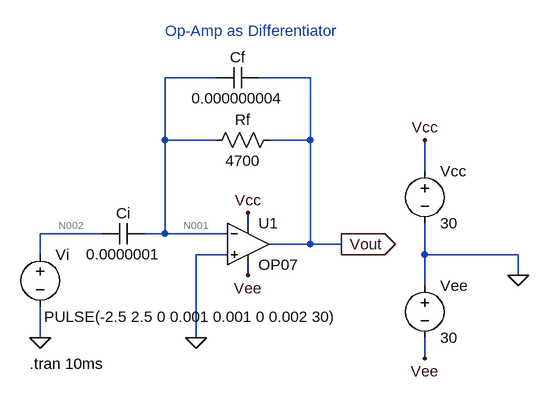
[diagram p0: schematic Assignment 9(ii).asc]
Assignment 9(ii).asc, the LTspice schematic file:
Version 4
SHEET 1 880 680
WIRE 144 -112 64 -112
WIRE 288 -112 208 -112
WIRE 64 -16 64 -112
WIRE 144 -16 64 -16
WIRE 288 -16 288 -112
WIRE 288 -16 224 -16
WIRE 464 32 464 -16
WIRE 192 112 192 96
WIRE -32 128 -128 128
WIRE 64 128 64 -16
WIRE 64 128 32 128
WIRE 160 128 64 128
WIRE 288 144 288 -16
WIRE 288 144 224 144
WIRE 336 144 288 144
WIRE -128 160 -128 128
WIRE 160 160 112 160
WIRE 464 160 464 112
WIRE 608 160 464 160
WIRE 192 192 192 176
WIRE 608 192 608 160
WIRE 464 208 464 160
WIRE -128 288 -128 240
WIRE 112 288 112 160
WIRE 464 320 464 288
FLAG -128 288 0
FLAG 112 288 0
FLAG 336 144 Vout
IOPIN 336 144 Out
FLAG 608 192 0
FLAG 464 -16 Vcc
FLAG 192 96 Vcc
FLAG 464 320 Vee
FLAG 192 192 Vee
SYMBOL Opamps\\OP07 192 80 R0
SYMATTR InstName U1
SYMBOL voltage 464 16 R0
WINDOW 123 0 0 Left 2
WINDOW 39 0 0 Left 2
SYMATTR InstName Vcc
SYMATTR Value 30
SYMBOL voltage 464 192 R0
WINDOW 123 0 0 Left 2
WINDOW 39 0 0 Left 2
SYMATTR InstName Vee
SYMATTR Value 30
SYMBOL voltage -128 144 R0
WINDOW 3 6 112 Left 2
WINDOW 123 0 0 Left 2
WINDOW 39 0 0 Left 2
SYMATTR InstName Vi
SYMATTR Value PULSE(-2.5 2.5 0 0.001 0.001 0 0.002 30)
SYMBOL cap 32 112 R90
WINDOW 0 0 32 VBottom 2
WINDOW 3 32 32 VTop 2
SYMATTR InstName Ci
SYMATTR Value 0.0000001
SYMBOL res 240 -32 R90
WINDOW 0 0 56 VBottom 2
WINDOW 3 32 56 VTop 2
SYMATTR InstName Rf
SYMATTR Value 4700
SYMBOL cap 208 -128 R90
WINDOW 0 0 32 VBottom 2
WINDOW 3 32 32 VTop 2
SYMATTR InstName Cf
SYMATTR Value 0.000000004
TEXT 64 -184 Left 2 ;Op-Amp as Differentiator
TEXT -144 328 Left 2 !.tran 10ms

The netlist it stands for:
* Assignment 9(ii).asc
XU1 0 N001 Vcc Vee Vout LT1001  ; OP07, pins In+ In- V+ V- OUT
Vcc Vcc 0 30
Vee 0 Vee 30
Vi N002 0 PULSE(-2.5 2.5 0 0.001 0.001 0 0.002 30)
Ci N001 N002 0.0000001
Rf Vout N001 4700
Cf Vout N001 0.000000004
* Op-Amp as Differentiator
.tran 10ms
.lib LTC.lib
.backanno
.end

* Results of the author's LTspice run, read from the files saved beside the schematic
* Operating Point, zero values left out:
*   V(vcc) = 30 V
*   V(n002) = -2.5 V
*   V(vee) = -30 V
*   I(Vcc) = -2.25 mA
*   I(Vee) = -2.25 mA
*   Ix(u1:3) = 2.25 mA
*   Ix(u1:4) = -2.25 mA
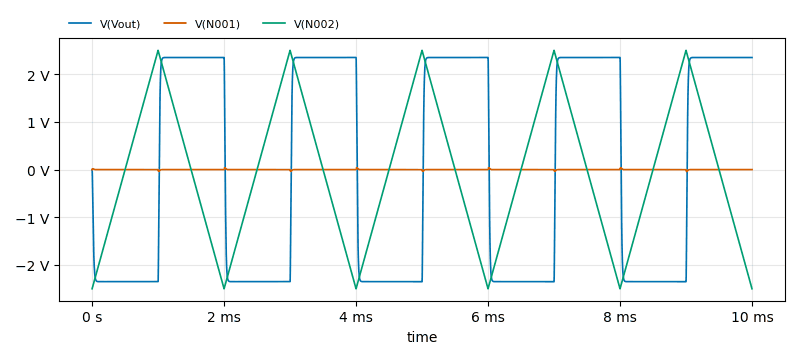
[diagram p1: Transient Analysis of Assignment 9(ii).asc, plotted from the saved traces]
* Transient Analysis, 1 run:
*   V(Vout): min -2.351 V, max 2.351 V, average -4.473 mV, rms 2.319 V, last 2.35 V
*   V(N001): min -40.24 mV, max 40.24 mV, average -54.84 µV, rms 5.14 mV, last -3.173 µV
*   V(N002): min -2.5 V, max 2.5 V, average 0 V, rms 1.444 V, last -2.5 V